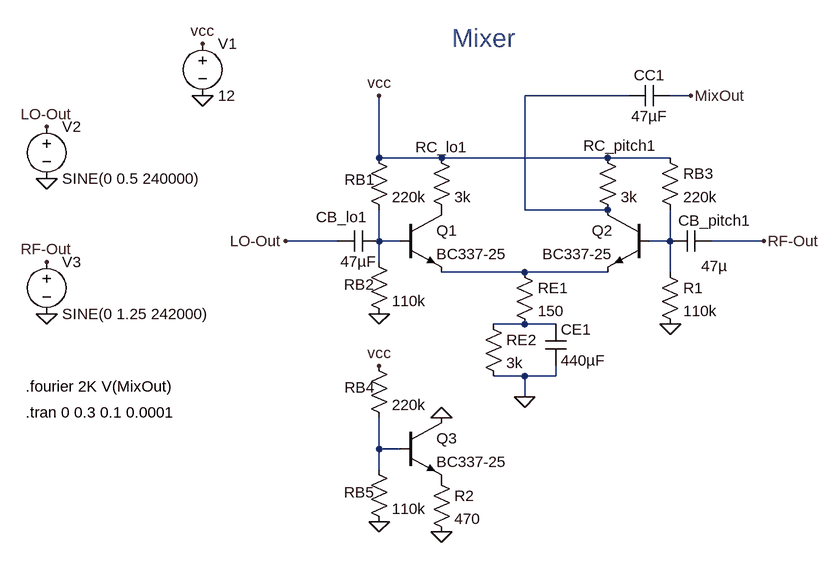
[diagram p0: schematic BJT-mixer-test.asc]
BJT-mixer-test.asc, the LTspice schematic file:
Version 4
SHEET 1 1396 708
WIRE 416 16 256 16
WIRE 512 16 480 16
WIRE 32 112 32 16
WIRE 128 112 32 112
WIRE 384 112 128 112
WIRE 480 112 384 112
WIRE 256 192 256 16
WIRE 384 192 256 192
WIRE -32 240 -112 240
WIRE 32 240 32 192
WIRE 64 240 32 240
WIRE 480 240 480 192
WIRE 480 240 448 240
WIRE 624 240 544 240
WIRE 32 272 32 240
WIRE 256 288 128 288
WIRE 384 288 256 288
WIRE 480 288 480 240
WIRE 256 368 208 368
WIRE 304 368 256 368
WIRE 256 448 208 448
WIRE 304 448 304 432
WIRE 304 448 256 448
WIRE 256 480 256 448
WIRE 32 560 32 512
WIRE 64 560 32 560
WIRE 32 592 32 560
FLAG 256 480 0
FLAG 32 352 0
FLAG 480 368 0
FLAG 512 16 MixOut
FLAG 32 432 vcc
FLAG -112 240 LO-Out
FLAG 624 240 RF-Out
FLAG -480 144 0
FLAG -480 352 0
FLAG -240 16 0
FLAG -480 64 LO-Out
FLAG -480 272 RF-Out
FLAG -240 -64 vcc
FLAG 32 672 0
FLAG 128 688 0
FLAG 32 16 vcc
FLAG 128 512 0
SYMBOL npn 64 192 R0
SYMATTR InstName Q1
SYMATTR Value BC337-25
SYMBOL npn 448 192 M0
SYMATTR InstName Q2
SYMATTR Value BC337-25
SYMBOL res 240 272 R0
SYMATTR InstName RE1
SYMATTR Value 150
SYMBOL res 192 352 R0
SYMATTR InstName RE2
SYMATTR Value 3k
SYMBOL cap 288 368 R0
SYMATTR InstName CE1
SYMATTR Value 440µF
SYMBOL res 16 96 R0
WINDOW 0 -37 49 Left 2
SYMATTR InstName RB1
SYMATTR Value 220k
SYMBOL res 16 256 R0
WINDOW 0 -38 51 Left 2
SYMATTR InstName RB2
SYMATTR Value 110k
SYMBOL res 464 272 R0
SYMATTR InstName R1
SYMATTR Value 110k
SYMBOL res 464 96 R0
SYMATTR InstName RB3
SYMATTR Value 220k
SYMBOL cap 32 224 R90
WINDOW 0 -5 58 VBottom 2
WINDOW 3 32 32 VTop 2
SYMATTR InstName CB_lo1
SYMATTR Value 47µF
SYMBOL cap 544 224 R90
WINDOW 0 0 -4 VBottom 2
WINDOW 3 39 -4 VTop 2
SYMATTR InstName CB_pitch1
SYMATTR Value 47µ
SYMBOL cap 480 0 R90
WINDOW 0 0 32 VBottom 2
WINDOW 3 32 32 VTop 2
SYMATTR InstName CC1
SYMATTR Value 47µF
SYMBOL res 368 96 R0
WINDOW 0 -22 -3 Left 2
SYMATTR InstName RC_pitch1
SYMATTR Value 3k
SYMBOL res 112 96 R0
WINDOW 0 -24 -1 Left 2
SYMATTR InstName RC_lo1
SYMATTR Value 3k
SYMBOL voltage -240 -80 R0
WINDOW 123 0 0 Left 0
WINDOW 39 0 0 Left 0
SYMATTR InstName V1
SYMATTR Value 12
SYMBOL voltage -480 48 R0
WINDOW 123 0 0 Left 0
WINDOW 39 0 0 Left 0
SYMATTR InstName V2
SYMATTR Value SINE(0 0.5 240000)
SYMBOL voltage -480 256 R0
WINDOW 123 0 0 Left 0
WINDOW 39 0 0 Left 0
SYMATTR InstName V3
SYMATTR Value SINE(0 1.25 242000)
SYMBOL npn 64 512 R0
SYMATTR InstName Q3
SYMATTR Value BC337-25
SYMBOL res 16 416 R0
WINDOW 0 -37 49 Left 2
SYMATTR InstName RB4
SYMATTR Value 220k
SYMBOL res 16 576 R0
WINDOW 0 -38 51 Left 2
SYMATTR InstName RB5
SYMATTR Value 110k
SYMBOL res 112 592 R0
SYMATTR InstName R2
SYMATTR Value 470
TEXT 144 -72 Left 4 ;Mixer
TEXT -512 504 Left 2 !.tran 0 0.3 0.1 0.0001
TEXT -512 464 Left 2 !.fourier 2K V(MixOut)

The netlist it stands for:
* BJT-mixer-test.asc
Q1 P001 N002 N004 0 BC337-25
Q2 N001 N003 N004 0 BC337-25
RE1 N004 N005 150
RE2 N005 0 3k
CE1 N005 0 440µF
RB1 vcc N002 220k
RB2 N002 0 110k
R1 N003 0 110k
RB3 vcc N003 220k
CB_lo1 N002 LO-Out 47µF
CB_pitch1 RF-Out N003 47µ
CC1 MixOut N001 47µF
RC_pitch1 vcc N001 3k
RC_lo1 vcc P001 3k
V1 vcc 0 12
V2 LO-Out 0 SINE(0 0.5 240000)
V3 RF-Out 0 SINE(0 1.25 242000)
Q3 0 N006 P002 0 BC337-25
RB4 vcc N006 220k
RB5 N006 0 110k
R2 P002 0 470
.model NPN NPN
.model PNP PNP
.lib standard.bjt
* Mixer
.tran 0 0.3 0.1 0.0001
.fourier 2K V(MixOut)
.backanno
.end